# EAGLE design tritiled_v30_lux_c_reverse (EAGLE 8.2.2)
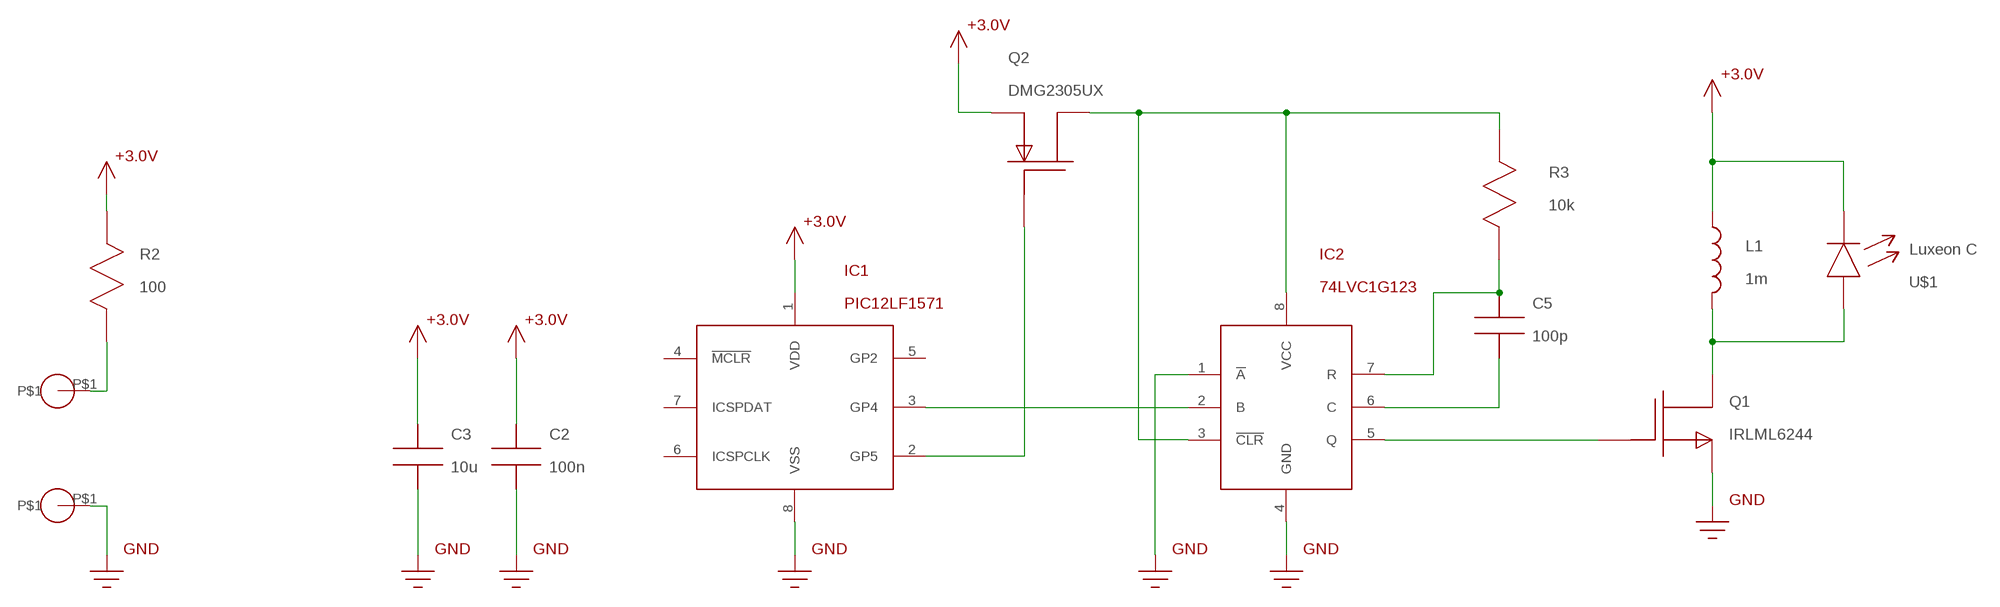
[diagram p0: schematic, sheet 1]

## Parts
C2  100n  C0805  [0805]
C3  10u  C1206  [1206]
C5  100p  C0603  [C0603]
IC1  PIC12LF1571  [SOIC8]
IC2  74LVC1G123  [SM8]
L1  1m  SRR6028_INDUCTOR  [SRR6028_INDUCTOR]
Q1  IRLML6244  ZXMN3B01FSOT23  [SOT-23]
Q2  DMG2305UX  DMG2305UXSOT23  [SOT-23]
R2  100  R1206  [R1206]
R3  10k  R0603  [R0603]
U$1  Luxeon C  LEDLUXEON_C  [LUXEON_C]
U$2  HDR_1_PIN  [HDR_1_PIN]
U$5  HDR_1_PIN  [HDR_1_PIN]

## Nets
+3.6V: C2.P$1 C3.P$1 IC1.1(VDD) L1.P$1 Q2.2(S) R2.P$1 U$1.C ; supply symbol labelled +3.0V
GND: C2.P$2 C3.P$2 IC1.8(VSS) IC2.1(!A!) IC2.4(GND) Q1.2(S) U$5.P$1
N$1: C5.P$1 IC2.7(R) R3.P$1
N$2: IC2.5(Q) Q1.1(G)
N$3: IC1.2(GP5) Q2.1(G)
N$4: IC1.3(GP4) IC2.2(B)
N$5: C5.P$2 IC2.6(C)
N$7: IC2.3(!CLR!) IC2.8(VCC) Q2.3(D) R3.P$2
N$9: R2.P$2 U$2.P$1
N$10: L1.P$2 Q1.3(D) U$1.A
Unconnected: IC1.4(!MCLR!) IC1.5(GP2) IC1.6(ICSPCLK) IC1.7(ICSPDAT)

## Library data of the parts
C2 C3 C5 = tritiled:C
IC1 = tritiled:PIC12LF1571
IC2 = tritiled:74LVC1G123
L1 = tritiled:SRR6028_INDUCTOR
Q1 = tritiled:ZXMN3B01F
Q2 = tritiled:DMG2305UX
R2 R3 = tritiled:R
U$1 = tritiled:LED
U$2 U$5 = tritiled:HDR_1_PIN

## Board
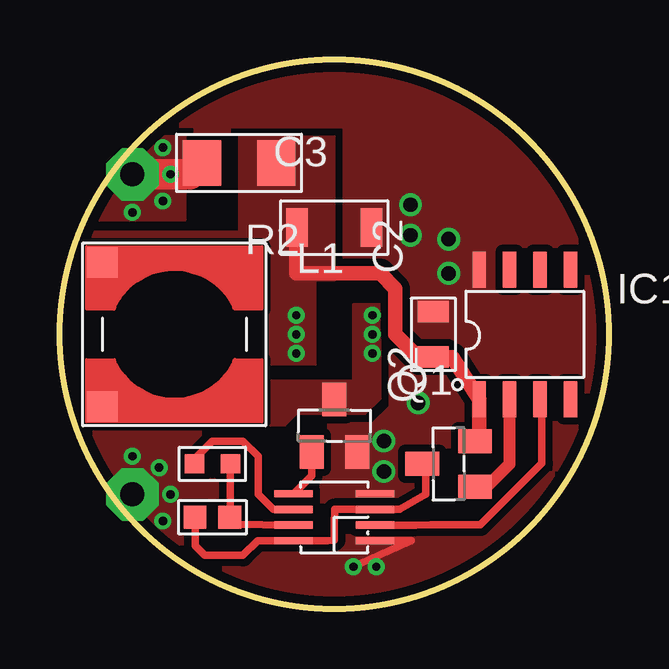
[diagram p1: board, top side]
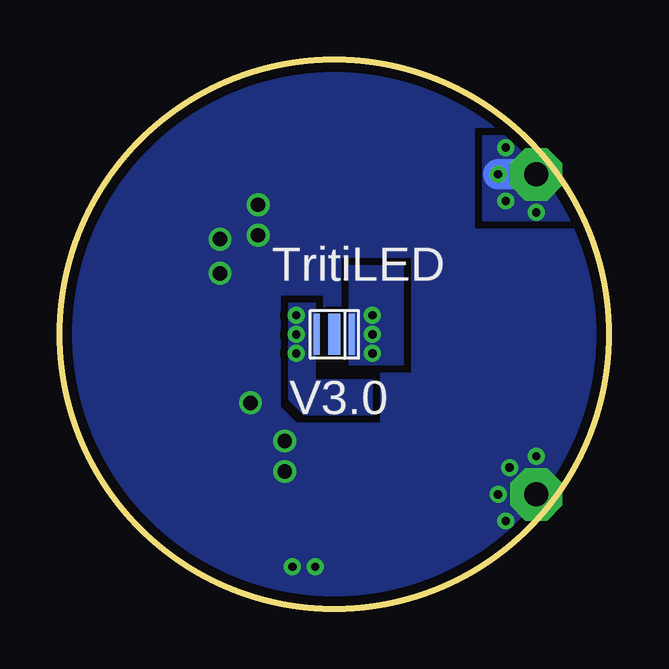
[diagram p2: board, bottom side, seen from below]

Size 22.86 x 22.86 mm. Coordinates in mm from the lower left corner, seen from the top.
Outline: circle at 11.43,11.43 radius 11.43
Copper layers (1*16): Top 0.0356mm / dielectric 1.5011mm / Bottom 0.0356mm
Design rules "LaenPCBOrder_tented_vias_12mil": minimum track width 8mil, minimum drill 13mil, track to track 12mil, track to pad 12mil, pad to pad 12mil, via to via 12mil, smd to smd 12mil, copper to edge 15mil, drill to drill 6mil, minimum pad ring 7mil, minimum via ring 7mil, stop-mask expansion 4mil, vias tented up to drill 28mil, thermal gap 10mil

### Footprints (pad centres in the part's own frame; a part is rotated, then mirrored left to right if it is on the bottom)
0805 = smd 0.9 x 1.3: P$1 -0.95,0; P$2 0.95,0
1206 = smd 0.9 x 1.6: P$1 -1.55,0; P$2 1.55,0
C0603 = smd 0.8 x 0.8: P$1 -0.75,0; P$2 0.75,0
SOIC8 = smd 0.55 x 1.5: 1 -1.905,-2.7; 2 -0.635,-2.7; 3 0.635,-2.7; 4 1.905,-2.7; 5 1.905,2.7; 6 0.635,2.7; 7 -0.635,2.7; 8 -1.905,2.7
SM8 = smd 0.3 x 1.6: 1 -0.975,-1.7; 2 -0.325,-1.7; 3 0.325,-1.7; 4 0.975,-1.7; 5 0.975,1.7; 6 0.325,1.7; 7 -0.325,1.7; 8 -0.975,1.7
SRR6028_INDUCTOR = smd 1.27 x 1.27: P$1 -3,3; P$2 -3,-3
SOT-23 = smd 1 x 1.4: 1 -0.95,-1.1; 2 0.95,-1.1; 3 0,1.1
R1206 = smd 1.6 x 1.9: P$1 -1.55,0; P$2 1.55,0
R0603 = smd 0.95 x 0.95: P$1 -0.725,0; P$2 0.725,0
LUXEON_C = smd 0.25 x 1.7: A -0.725,0; C 0.725,0 | smd 0.5 x 1.7: HS 0,0
HDR_1_PIN = drill 1 pad 2.184 octagon: P$1 0,0

### Placement (x,y rotation side)
C2  15.56,11.43 90 top
C3  11.43,15.88 0 top
C5  6.35,6.03 180 top
IC1  19.37,11.43 0 top
IC2  11.43,3.81 90 top
L1  4.76,11.43 0 top
Q1  11.43,7.62 0 top
Q2  16.19,6.03 90 top
R2  7.46,18.57 180 top
R3  6.35,3.81 180 top
U$1  11.43,11.43 0 bottom
U$2  3.02,18.1 0 top
U$5  3.02,4.76 0 top

### Tracks (layer width: path | path; a pad name or v marks a point on that pad's centre or on a via)
+3.6V  (via drill 0.35)
  Top 0.61: C3.P$1 9.84,15.44 9.84,13.97 13.34,13.97 13.97,13.34 13.97,11.43 14.92,10.48 C2.P$1 16.35,10.48 IC1.1 17.46,7.15 Q2.2
  other vias: 9.84,12.22 9.84,11.43 9.84,10.64
  pour Top (no thermals): 11.43,19.68 11.43,13.65 10.64,13.65 10.64,10.16 8.73,10.16 8.73,12.54 6.35,13.97 4.45,13.97 3.17,14.61 1.27,14.61 1.27,15.72 7.62,15.72 7.62,19.68
  pour Bottom (no thermals): 10.79,10.64 10.79,14.29 8.57,14.29 8.57,10.16 10.79,10.16
  pour Top (no thermals): 11.43,13.65 10.64,13.65 10.64,10.16 8.73,10.16 8.73,12.54 6.35,13.97 4.45,13.97 1.27,14.61
  pour Top (no thermals): 11.43,19.68 11.43,13.65 10.64,13.65 10.64,10.16 8.73,10.16 8.73,12.54 6.35,13.97 4.45,13.97 1.27,14.61 1.27,15.72 7.46,15.72 7.46,19.68
GND  (via drill 0.35, 0.6)
  Top 0.305: IC2.1 14.63,2.83 v12.22,1.75
  other vias: 16.19,15.4 16.19,13.97 13.49,6.99 13.49,5.71 14.61,16.83 14.61,15.56 14.92,8.57 13.18,1.75 3.02,6.35 4.13,5.87 4.6,4.76 4.29,3.65
  pour Top (rank 2, no thermals): 0,0 0,23.18 23.18,22.86 23.18,-0.32
  pour Bottom (rank 2, no thermals): 0,0 0,23.18 23.18,22.86 23.18,-0.32
N$1
  Top 0.305: IC2.7 7.15,3.52 7.04,3.84 R3.P$1 | R3.P$1 | R3.P$1 7.1,3.83 C5.P$1
N$2
  Top 0.305: IC2.5 10.48,5.54 Q1.1
N$3
  Top 0.508: Q2.1 17.78,5.08 18.73,6.03 IC1.2
N$4
  Top 0.305: IC2.2 14.82,3.48 15.45,3.49 17.51,3.49 20.08,6.05 20.08,8.33 20,8.57 IC1.3
N$5
  Top 0.305: IC2.6 8.88,4.13 8.26,4.76 8.26,6.35 7.62,6.99 6.35,6.99 5.71,6.35 5.71,5.83 C5.P$2
N$7
  Top 0.305: R3.P$2 5.62,2.63 6.03,2.22 7.62,2.22 8.23,2.83 IC2.8 11.13,2.83 11.43,2.86 11.43,3.49 11.44,4.13 IC2.3 14.15,4.13 15.24,4.76 15.24,5.88 Q2.3
N$9  (via drill 0.35)
  Top 1.27: U$2.P$1 v4.6,18.1 5.4,18.1 5.87,18.57
  Bottom 1.27: U$2.P$1 v4.6,18.1
  other vias: 4.29,16.99 4.29,19.21 3.02,16.51
  pour Bottom (no thermals): 3.17,19.68 5.24,19.68 5.24,16.19 1.11,16.19 1.11,17.62
  pour Top (no thermals): 5.24,16.19 5.24,19.68 1.59,19.68 1.59,16.19
N$10  (via drill 0.35)
  other vias: 13.02,12.22 13.02,11.43 13.02,10.64
  pour Top (no thermals): 12.22,12.7 13.34,12.7 13.34,8.73 12.7,8.1 9.84,8.1 9.37,7.62 1.27,7.62 1.27,8.26 6.35,8.26 6.99,9.53 12.22,9.53
  pour Bottom (no thermals): 12.22,12.7 13.34,12.7 13.34,8.73 12.7,8.1 9.84,8.1 9.84,9.53 12.22,9.53

### Text on the board
bPlace: TritiLED | V3.0